# Altium schematic sheet Master.SchDoc
size A4; Organization: Altium Limited; Address1: L3, 12a Rodborough Rd; Address2: Frenchs Forest; Address3: NSW; Address4: Australia 2086
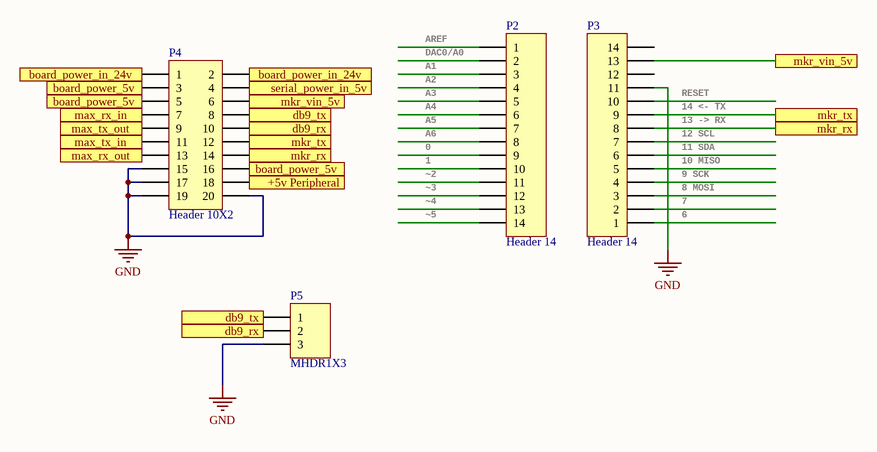
[diagram p0: Master.SchDoc]

## Parts
P2  Header 14  [HDR1X14]
P3  Header 14  [HDR1X14]
P4  Header 10X2  [HDR2X10]
P5  MHDR1X3  [MHDR1X3]

## Ports
+5v Peripheral, board_power_5v, board_power_in_24v, db9_rx, db9_tx, max_rx_in, max_rx_out, max_tx_in, max_tx_out, mkr_rx, mkr_tx, mkr_vin_5v, serial_power_in_5v

## Nets
GND: P3.11 P4.15 P4.17 P4.19 P4.20 P5.3
+5v Peripheral: P4.18 ; port +5v Peripheral
board_power_5v: P4.3 P4.5 P4.16 ; port board_power_5v
board_power_in_24v: P4.1 P4.2 ; port board_power_in_24v
db9_rx: P4.10 P5.2 ; port db9_rx
db9_tx: P4.8 P5.1 ; port db9_tx
max_rx_in: P4.7 ; port max_rx_in
max_rx_out: P4.13 ; port max_rx_out
max_tx_in: P4.11 ; port max_tx_in
max_tx_out: P4.9 ; port max_tx_out
mkr_rx: P3.8 P4.14 ; port mkr_rx
mkr_tx: P3.9 P4.12 ; port mkr_tx
mkr_vin_5v: P3.13 P4.6 ; port mkr_vin_5v
serial_power_in_5v: P4.4 ; port serial_power_in_5v

Not connected (* = marked no-connect by the designer): P2 1 2 3 4 5 6 7 8 9 10 11 12 13 14; P3 1 2 3 4 5 6 7 10 12 14

## Notes on the sheet
- AREF
- (near P2) DAC0/A0
- A1
- A2
- A3
- A4
- A5
- A6
- 14 <- TX
- 13 -> RX
- 12 SCL
- RESET
- 0
- 1
- ~2
- ~3
- ~4
- 11 SDA
- 7
- 8 MOSI
- 9 SCK
- 10 MISO
- ~5
- 6
- Title
- Size:
- Date:
- Number:
- Time:
- Revision:
- Sheet
- of
- File:

## Library data of the parts
P2 P3 = Header 14: Header, 14-Pin; LatestRevisionDate: 17-Jul-2002; LatestRevisionNote: Re-released for DXP Platform.; Publisher: Altium Limited
P4 = Header 10X2: Header, 10-Pin, Dual row; LatestRevisionDate: 17-Jul-2002; LatestRevisionNote: Re-released for DXP Platform.; Publisher: Altium Limited
P5 = MHDR1X3: Header, 3-Pin; LatestRevisionDate: 17-Jul-2002; LatestRevisionNote: Re-released for DXP Platform.; Publisher: Altium Limited